# EAGLE schematic MediaProjectLedBoard (EAGLE 8.2.1)
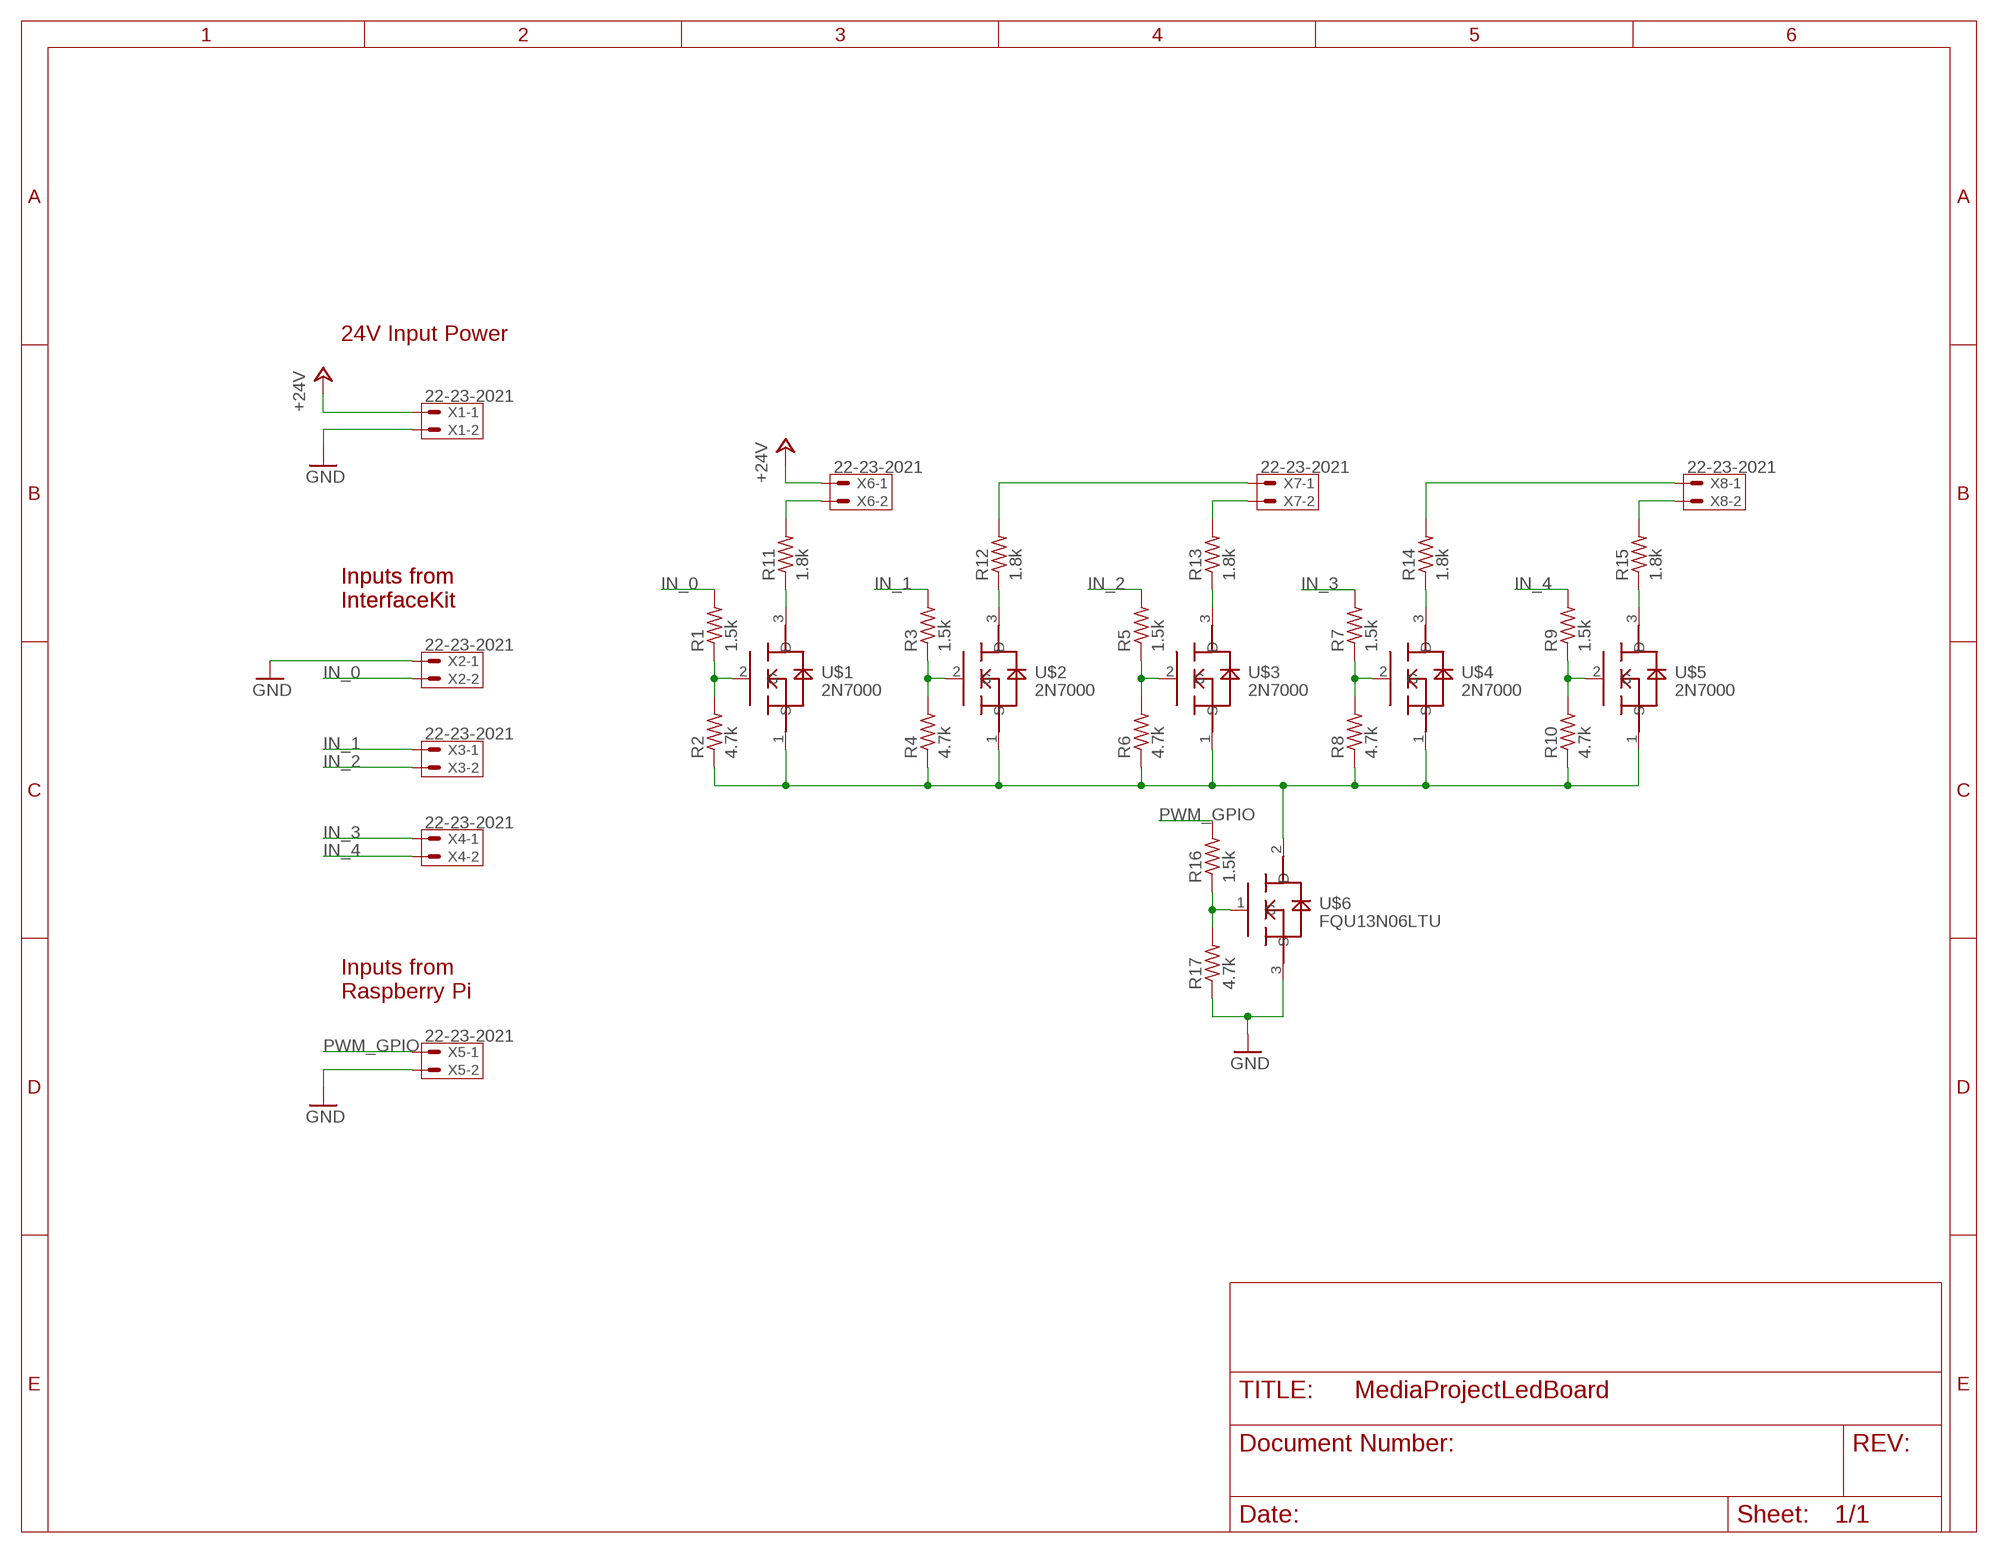
[diagram p0: schematic, sheet 1]

## Parts
R1  1.5k  R-US_0309/12  [0309/12]
R2  4.7k  R-US_0309/12  [0309/12]
R3  1.5k  R-US_0309/12  [0309/12]
R4  4.7k  R-US_0309/12  [0309/12]
R5  1.5k  R-US_0309/12  [0309/12]
R6  4.7k  R-US_0309/12  [0309/12]
R7  1.5k  R-US_0309/12  [0309/12]
R8  4.7k  R-US_0309/12  [0309/12]
R9  1.5k  R-US_0309/12  [0309/12]
R10  4.7k  R-US_0309/12  [0309/12]
R11  1.8k  R-US_0309/12  [0309/12]
R12  1.8k  R-US_0309/12  [0309/12]
R13  1.8k  R-US_0309/12  [0309/12]
R14  1.8k  R-US_0309/12  [0309/12]
R15  1.8k  R-US_0309/12  [0309/12]
R16  1.5k  R-US_0309/12  [0309/12]
R17  4.7k  R-US_0309/12  [0309/12]
U$1  2N7000  [TO92-]
U$2  2N7000  [TO92-]
U$3  2N7000  [TO92-]
U$4  2N7000  [TO92-]
U$5  2N7000  [TO92-]
U$6  FQU13N06LTU  [TO251AA-V]
X1  22-23-2021  [22-23-2021]
X2  22-23-2021  [22-23-2021]
X3  22-23-2021  [22-23-2021]
X4  22-23-2021  [22-23-2021]
X5  22-23-2021  [22-23-2021]
X6  22-23-2021  [22-23-2021]
X7  22-23-2021  [22-23-2021]
X8  22-23-2021  [22-23-2021]

## Nets
+24V: X1.1 X6.1
GND: R17.1 U$6.3(S) X1.2 X2.1 X5.2
IN_0: R1.2 X2.2
IN_1: R3.2 X3.1
IN_2: R5.2 X3.2
IN_3: R7.2 X4.1
IN_4: R9.2 X4.2
N$1: R1.1 R2.2 U$1.2(G)
N$2: R11.1 U$1.3(D)
N$3: R3.1 R4.2 U$2.2(G)
N$4: R12.1 U$2.3(D)
N$5: R13.1 U$3.3(D)
N$6: R5.1 R6.2 U$3.2(G)
N$7: R7.1 R8.2 U$4.2(G)
N$8: R14.1 U$4.3(D)
N$11: R9.1 R10.2 U$5.2(G)
N$12: R15.1 U$5.3(D)
N$13: R2.1 R4.1 R6.1 R8.1 R10.1 U$1.1(S) U$2.1(S) U$3.1(S) U$4.1(S) U$5.1(S) U$6.2(D)
N$14: R16.1 R17.2 U$6.1(G)
N$15: R11.2 X6.2
N$16: R13.2 X7.2
N$17: R12.2 X7.1
N$18: R14.2 X8.1
N$19: R15.2 X8.2
PWM_GPIO: R16.2 X5.1

## Notes on the sheet
- 24V Input Power
- Inputs from
  InterfaceKit
- Inputs from
  InterfaceKit
- Inputs from
  Raspberry Pi

## Library data of the parts
R1-R17 = resistor:R-US_: RESISTOR, American symbol
U$1-U$5 = MediaProjectLib:2N7000
U$6 = MediaProjectLib:FQU13N06LTU
X1-X8 = con-molex:22-23-2021: .100" (2.54mm) Center Header - 2 Pin; MF: MOLEX; MPN: 22-23-2021; OC_FARNELL: 1462926; OC_NEWARK: 25C3832